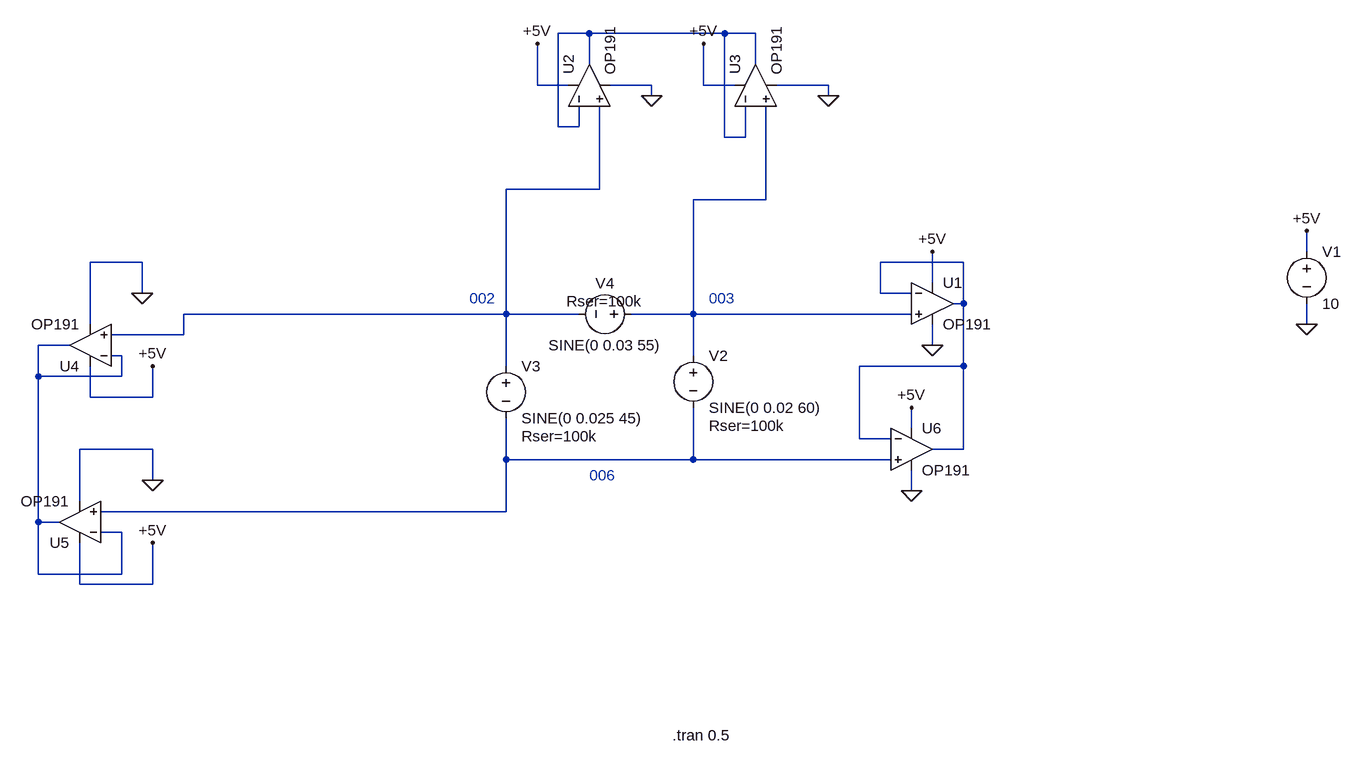
[diagram p0: schematic averaging buffers.asc]
averaging buffers.asc, the LTspice schematic file:
Version 4
SHEET 1 880 680
WIRE -800 -512 -848 -512
WIRE -592 -512 -800 -512
WIRE -544 -512 -592 -512
WIRE -800 -464 -800 -512
WIRE -544 -464 -544 -512
WIRE -880 -432 -880 -496
WIRE -832 -432 -880 -432
WIRE -704 -432 -768 -432
WIRE -624 -432 -624 -496
WIRE -576 -432 -624 -432
WIRE -432 -432 -512 -432
WIRE -704 -416 -704 -432
WIRE -432 -416 -432 -432
WIRE -848 -368 -848 -512
WIRE -816 -368 -816 -400
WIRE -816 -368 -848 -368
WIRE -592 -352 -592 -512
WIRE -560 -352 -560 -400
WIRE -560 -352 -592 -352
WIRE -784 -272 -784 -400
WIRE -784 -272 -928 -272
WIRE -528 -256 -528 -400
WIRE -528 -256 -640 -256
WIRE 304 -176 304 -208
WIRE -1488 -160 -1568 -160
WIRE -224 -160 -352 -160
WIRE -272 -128 -272 -176
WIRE -1488 -112 -1488 -160
WIRE -352 -112 -352 -160
WIRE -304 -112 -352 -112
WIRE -224 -96 -224 -160
WIRE -224 -96 -240 -96
WIRE -928 -80 -928 -272
WIRE -928 -80 -1424 -80
WIRE -816 -80 -928 -80
WIRE -640 -80 -640 -256
WIRE -640 -80 -736 -80
WIRE -304 -80 -640 -80
WIRE -1568 -64 -1568 -160
WIRE 304 -64 304 -96
WIRE -1424 -48 -1424 -80
WIRE -1424 -48 -1536 -48
WIRE -1600 -32 -1648 -32
WIRE -272 -32 -272 -64
WIRE -1520 -16 -1536 -16
WIRE -640 -16 -640 -80
WIRE -928 0 -928 -80
WIRE -224 0 -224 -96
WIRE -224 0 -384 0
WIRE -1648 16 -1648 -32
WIRE -1520 16 -1520 -16
WIRE -1520 16 -1648 16
WIRE -1568 48 -1568 0
WIRE -1472 48 -1472 0
WIRE -1472 48 -1568 48
WIRE -304 96 -304 64
WIRE -384 112 -384 0
WIRE -336 112 -384 112
WIRE -1472 128 -1584 128
WIRE -224 128 -224 0
WIRE -224 128 -272 128
WIRE -928 144 -928 80
WIRE -640 144 -640 64
WIRE -640 144 -928 144
WIRE -336 144 -640 144
WIRE -1472 176 -1472 128
WIRE -304 192 -304 160
WIRE -1584 208 -1584 128
WIRE -928 224 -928 144
WIRE -928 224 -1552 224
WIRE -1648 240 -1648 16
WIRE -1616 240 -1648 240
WIRE -1520 256 -1552 256
WIRE -1648 320 -1648 240
WIRE -1520 320 -1520 256
WIRE -1520 320 -1648 320
WIRE -1584 336 -1584 272
WIRE -1472 336 -1472 272
WIRE -1472 336 -1584 336
FLAG -304 192 0
FLAG 304 -64 0
FLAG 304 -208 +5V
FLAG -304 64 +5V
FLAG -272 -32 0
FLAG -272 -176 +5V
FLAG -432 -416 0
FLAG -704 -416 0
FLAG -1488 -112 0
FLAG -1472 176 0
FLAG -1472 0 +5V
FLAG -1472 272 +5V
FLAG -624 -496 +5V
FLAG -880 -496 +5V
SYMBOL voltage 304 -192 R0
WINDOW 123 0 0 Left 0
WINDOW 39 0 0 Left 0
SYMATTR InstName V1
SYMATTR Value 10
SYMBOL voltage -640 -32 R0
WINDOW 123 0 0 Left 0
WINDOW 39 24 124 Left 2
SYMATTR InstName V2
SYMATTR Value SINE(0 0.02 60)
SYMATTR SpiceLine Rser=100k
SYMBOL OpAmps\\OP191 -304 64 R0
SYMATTR InstName U6
SYMBOL OpAmps\\OP191 -272 -160 R0
SYMATTR InstName U1
SYMBOL voltage -928 -16 R0
WINDOW 123 0 0 Left 0
WINDOW 39 24 124 Left 2
SYMATTR InstName V3
SYMATTR Value SINE(0 0.025 45)
SYMATTR SpiceLine Rser=100k
SYMBOL voltage -720 -80 R90
WINDOW 0 -32 56 VBottom 2
WINDOW 3 32 56 VTop 2
WINDOW 123 0 0 Left 0
WINDOW 39 -4 56 VBottom 2
SYMATTR InstName V4
SYMATTR Value SINE(0 0.03 55)
SYMATTR SpiceLine Rser=100k
SYMBOL OpAmps\\OP191 -864 -432 R270
SYMATTR InstName U2
SYMBOL OpAmps\\OP191 -608 -432 R270
SYMATTR InstName U3
SYMBOL OpAmps\\OP191 -1568 32 R180
SYMATTR InstName U4
SYMBOL OpAmps\\OP191 -1584 304 R180
SYMATTR InstName U5
TEXT -672 568 Left 2 !.tran 0.5
TEXT -616 -104 Left 2 ;003
TEXT -984 -104 Left 2 ;002
TEXT -800 168 Left 2 ;006

The netlist it stands for:
* averaging buffers.asc
V1 +5V 0 10
V2 N003 N006 SINE(0 0.02 60) Rser=100k
XU6 N006 N004 +5V 0 N004 OP191  ; pins In+ In- V+ V- OUT
XU1 N003 N004 +5V 0 N004 OP191  ; pins In+ In- V+ V- OUT
V3 N002 N006 SINE(0 0.025 45) Rser=100k
V4 N003 N002 SINE(0 0.03 55) Rser=100k
XU2 N002 N001 +5V 0 N001 OP191  ; pins In+ In- V+ V- OUT
XU3 N003 N001 +5V 0 N001 OP191  ; pins In+ In- V+ V- OUT
XU4 N002 N005 +5V 0 N005 OP191  ; pins In+ In- V+ V- OUT
XU5 N006 N005 +5V 0 N005 OP191  ; pins In+ In- V+ V- OUT
.tran 0.5
* 003
* 002
* 006
.lib ADI.lib
.backanno
.end